# EAGLE design main (EAGLE 6.5.0)
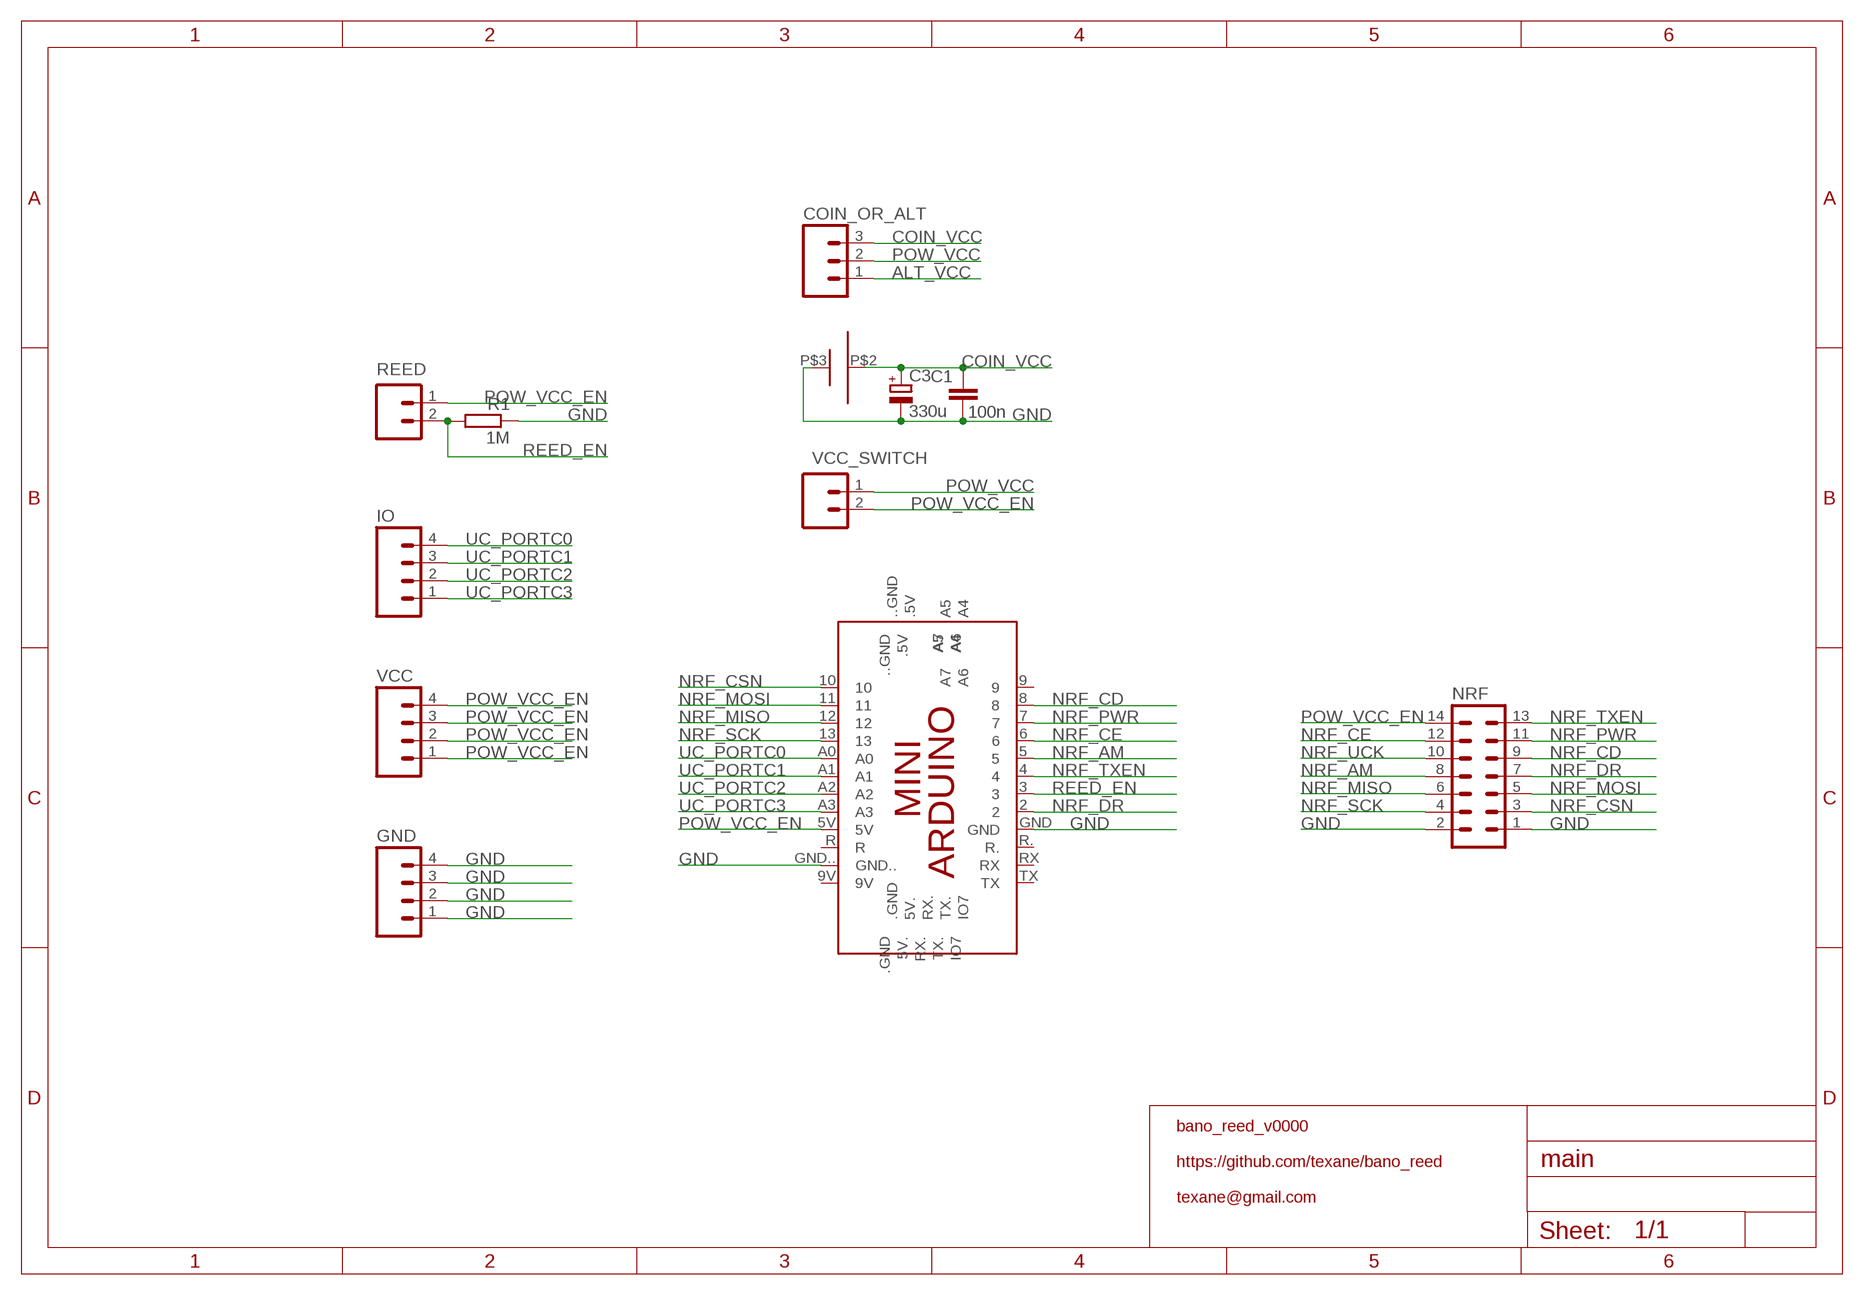
[diagram p0: schematic, sheet 1]

## Parts
C1  100n  C-EUC1206K  [C1206K]
C3  330u  CPOL-EUF  [PANASONIC_F]
COIN_OR_ALT  M03PTH  [1X03]
GND  M04PTH  [1X04]
IO  M04PTH  [1X04]
NRF  MA07-2  [MA07-2]
PCB1  ARDUINO_MINI  [ARDUINO_MINI]
R1  1M  R-EU_R1206  [R1206]
REED  M02PTH  [1X02]
U$1  KEYSTONE_1025_7  [KEYSTONE_1025_7]
VCC  M04PTH  [1X04]
VCC_SWITCH  M02PTH  [1X02]

## Nets
ALT_VCC: COIN_OR_ALT.1
COIN_VCC: C1.1 C3.+ COIN_OR_ALT.3 U$1.P$2(COIN_PLUS)
GND: C1.2 C3.- GND.1 GND.2 GND.3 GND.4 NRF.1 NRF.2 PCB1.GND PCB1.GND.. R1.1 U$1.P$3(COIN_MINUS)
NRF_AM: NRF.8 PCB1.5
NRF_CD: NRF.9 PCB1.8
NRF_CE: NRF.12 PCB1.6
NRF_CSN: NRF.3 PCB1.10
NRF_DR: NRF.7 PCB1.2
NRF_MISO: NRF.6 PCB1.12
NRF_MOSI: NRF.5 PCB1.11
NRF_PWR: NRF.11 PCB1.7
NRF_SCK: NRF.4 PCB1.13
NRF_TXEN: NRF.13 PCB1.4
NRF_UCK: NRF.10
POW_VCC: COIN_OR_ALT.2 VCC_SWITCH.1
POW_VCC_EN: NRF.14 PCB1.5V REED.1 VCC.1 VCC.2 VCC.3 VCC.4 VCC_SWITCH.2
REED_EN: PCB1.3 R1.2 REED.2
UC_PORTC0: IO.4 PCB1.A0
UC_PORTC1: IO.3 PCB1.A1
UC_PORTC2: IO.2 PCB1.A2
UC_PORTC3: IO.1 PCB1.A3
Unconnected: PCB1.5V. PCB1.9 PCB1.9V PCB1..5V PCB1...GND PCB1..GND PCB1.A4 PCB1.A5 PCB1.A6 PCB1.A7 PCB1.IO7 PCB1.R PCB1.R. PCB1.RX PCB1.RX. PCB1.TX PCB1.TX.

## Notes on the sheet
- bano_reed_v0000
- https://github.com/texane/bano_reed
- texane@gmail.com

## Library data of the parts
C1 = rcl:C-EU: CAPACITOR, European symbol
C3 = rcl:CPOL-EU: POLARIZED CAPACITOR, European symbol
COIN_OR_ALT = SparkFun:M03: Header 3 Standard 3-pin 0.1" header. Use with straight break away headers (SKU : PRT-00116), right angle break away headers (PRT-00553), swiss pins (PRT-00743), machine pins (PRT-00117), and female headers (PRT-00115). Molex polarized connector foot print use with SKU : PRT-08232 with associated crimp pins and housings.
GND IO VCC = SparkFun:M04: Header 4 Standard 4-pin 0.1" header. Use with straight break away headers (SKU : PRT-00116), right angle break away headers (PRT-00553), swiss pins (PRT-00743), machine pins (PRT-00117), and female headers (PRT-00115). Molex polarized connector foot print use with SKU : PRT-08231 with associated crimp pins and housings. 1MM SMD Version SKU: PRT-10208
NRF = con-lstb:MA07-2: PIN HEADER; OC_FARNELL: unknown; OC_NEWARK: unknown
PCB1 = E14_Arduino:ARDUINO_MINI: Device for representing an Arduino Mini board with a footprint in an EAGLE design. Created by Dave Young for Element14. More EAGLE documentation at: http://www.element14.com/community/community/knode/cadsoft_eagle
R1 = resistor:R-EU_: RESISTOR, European symbol
REED VCC_SWITCH = SparkFun:M02: Header 2 Standard 2-pin 0.1" header. Use with straight break away headers (SKU : PRT-00116), right angle break away headers (PRT-00553), swiss pins (PRT-00743), machine pins (PRT-00117), and female headers (PRT-00115). Molex polarized connector foot print use with SKU : PRT-08233 with associated crimp pins and housings.
U$1 = keystone_1025_7:KEYSTONE_1025_7

## Board
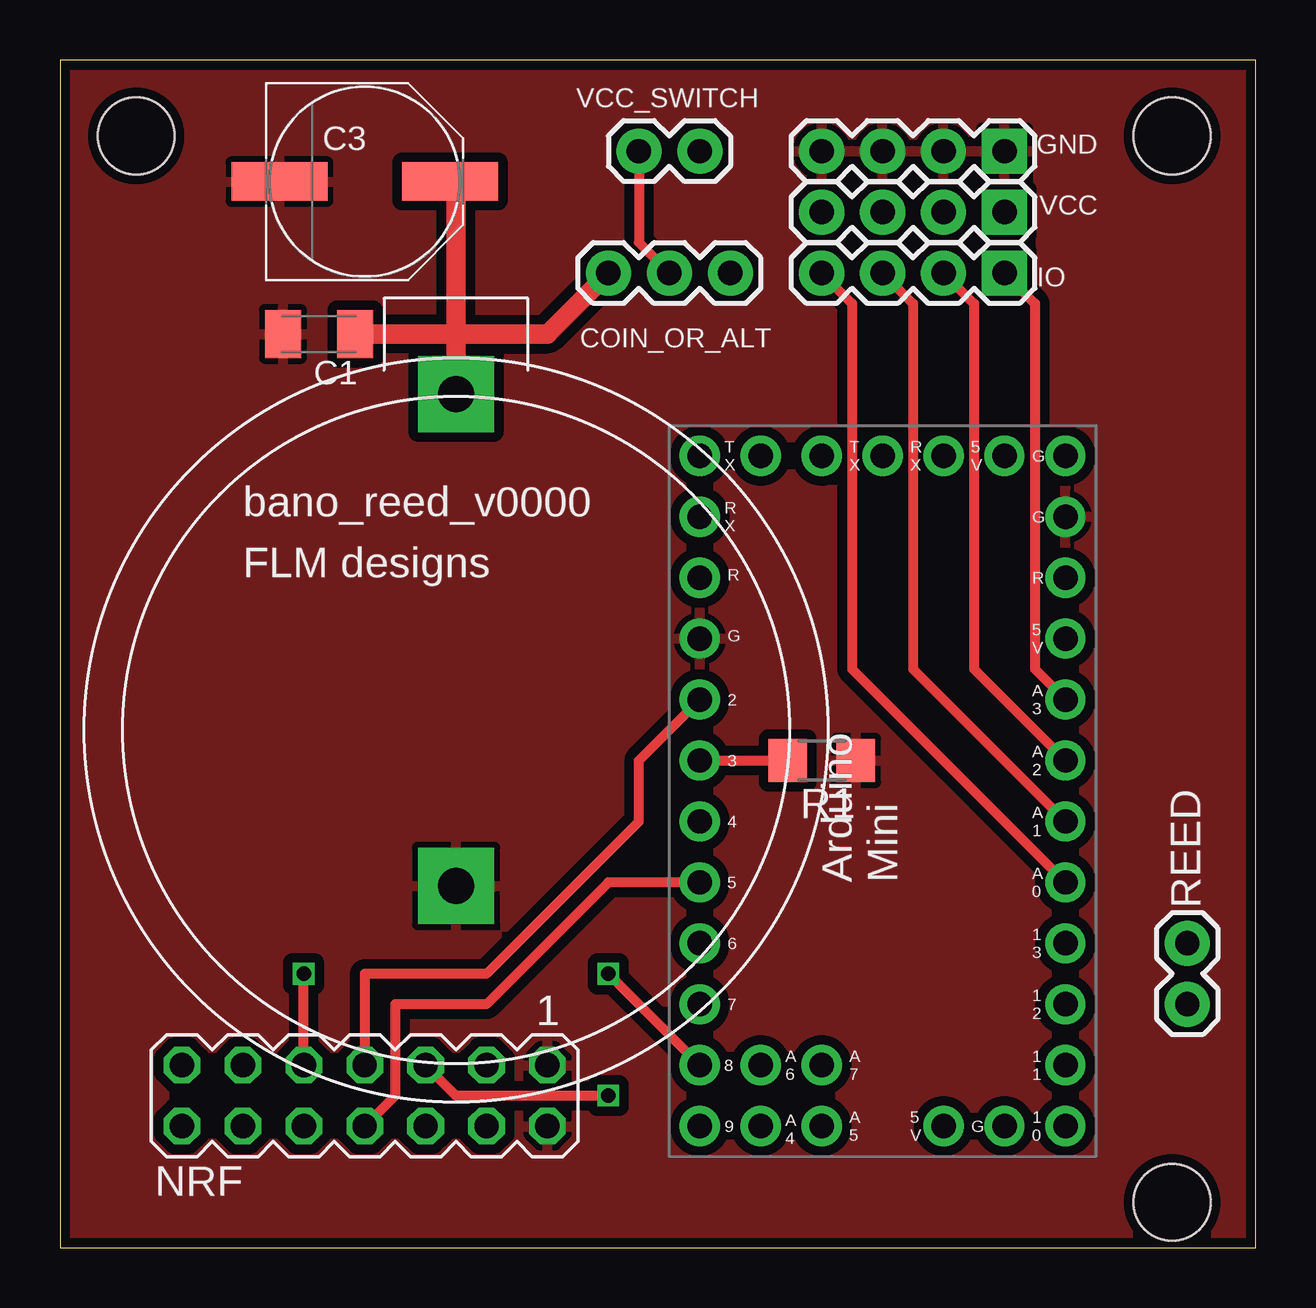
[diagram p1: board, top side]
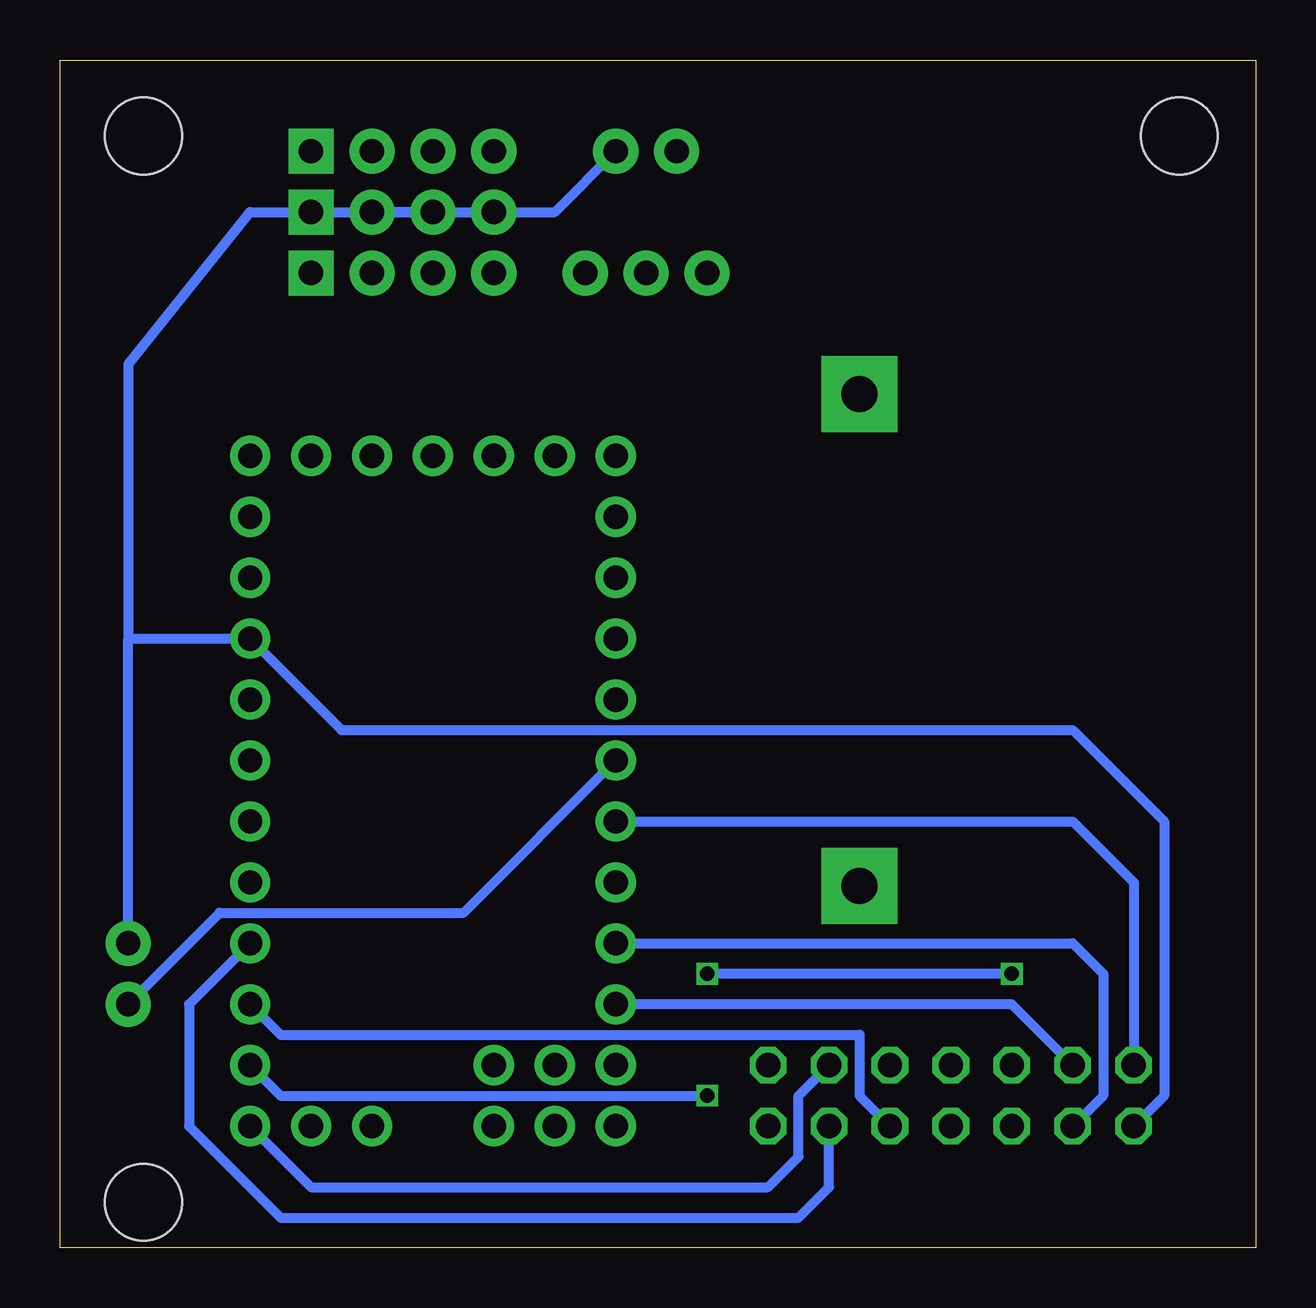
[diagram p2: board, bottom side, seen from below]

Size 49.84 x 49.52 mm. Coordinates in mm from the lower left corner, seen from the top.
Outline: 0,0 49.84,0 49.84,49.52 0,49.52 0,0
Copper layers (1*16): Top 0.035mm / dielectric 1.5mm / Bottom 0.035mm
Design rules "SeeedStudio_DRU_no_angle_2layer": minimum track width 6mil, minimum drill 12mil, track to track 6mil, track to pad 6mil, pad to pad 6mil, via to via 6mil, smd to smd 0mil, copper to edge 10mil, drill to drill 10mil, minimum pad ring 10mil, minimum via ring 6mil, stop-mask expansion 2mil, vias tented up to drill 25mil, thermal gap 10mil
Holes 3.2 mm at 3.17,46.35 46.35,46.35 46.35,1.91

### Footprints (pad centres in the part's own frame; a part is rotated, then mirrored left to right if it is on the bottom)
C1206K = smd 1.5 x 2: 1 -1.5,0; 2 1.5,0
PANASONIC_F = smd 4 x 1.6: + 3.55,0; - -3.55,0
1X03 = drill 1.016 pad 1.88: 1 0,0; 2 2.54,0; 3 5.08,0
1X04 = drill 1.016 pad 1.88 square: 1 0,0 | drill 1.016 pad 1.88: 2 2.54,0; 3 5.08,0; 4 7.62,0
MA07-2 = drill 1.016 octagon: 1 -7.62,-1.27; 2 -7.62,1.27; 3 -5.08,-1.27; 4 -5.08,1.27; 5 -2.54,-1.27; 6 -2.54,1.27; 7 0,-1.27; 8 0,1.27; 9 2.54,-1.27; 10 2.54,1.27; 11 5.08,-1.27; 12 5.08,1.27; 13 7.62,-1.27; 14 7.62,1.27
ARDUINO_MINI = drill 1.016 pad 1.676: 2 19.05,16.51; 3 16.51,16.51; 4 13.97,16.51; 5 11.43,16.51; 5V 21.59,1.27; 5V. 29.21,6.35; 6 8.89,16.51; 7 6.35,16.51; 8 3.81,16.51; 9 1.27,16.51; 9V 29.21,1.27; 10 1.27,1.27; 11 3.81,1.27; 12 6.35,1.27; 13 8.89,1.27; .5V 1.27,6.35; ..GND 1.27,3.81; .GND 29.21,3.81; A0 11.43,1.27; A1 13.97,1.27; A2 16.51,1.27; A3 19.05,1.27; A4 1.27,13.97; A5 1.27,11.43; A6 3.81,13.97; A7 3.81,11.43; GND 21.59,16.51; GND.. 26.67,1.27; IO7 29.21,13.97; R 24.13,1.27; R. 24.13,16.51; RX 26.67,16.51; RX. 29.21,8.89; TX 29.21,16.51; TX. 29.21,11.43
R1206 = smd 1.6 x 1.803: 1 -1.422,0; 2 1.422,0
1X02 = drill 1.016 pad 1.88: 1 0,0; 2 2.54,0
KEYSTONE_1025_7 = drill 1.5 pad 3.175 square: P$2 0,-14; P$3 0,6.5

### Placement (x,y rotation side)
C1  10.79,38.1 180 top
C3  12.7,44.45 0 top
COIN_OR_ALT  27.94,40.64 180 top
GND  39.37,45.72 180 top
IO  39.37,40.64 180 top
NRF  12.7,6.35 180 top
PCB1  43.18,3.81 90 top
R1  31.75,20.32 180 top
REED  46.99,12.7 270 top
U$1  16.51,21.59 180 top
VCC  39.37,43.18 180 top
VCC_SWITCH  24.13,45.72 0 top

### Tracks (layer width: path | path; a pad name or v marks a point on that pad's centre or on a via)
COIN_VCC
  Top 0.406: 16.51,44.45 C3.+
  Top 0.813: 16.51,38.1 20.32,38.1 COIN_OR_ALT.3 | 16.51,38.1 C1.1 | U$1.P$2 16.51,38.1 | 16.51,38.1 16.51,44.45
GND
  pour Top (isolate 0.406): 0,49.53 50.16,49.53 50.16,0 0,0
NRF_AM
  Top 0.406: PCB1.5 22.86,15.24 17.78,10.16 13.97,10.16 13.97,6.35 NRF.8
NRF_CD  (via drill 0.6)
  Top 0.406: NRF.9 v10.16,11.43 | PCB1.8 v22.86,11.43
  Bottom 0.406: v10.16,11.43 v22.86,11.43
NRF_CE
  Bottom 0.406: PCB1.6 7.62,12.7 6.35,11.43 6.35,6.35 NRF.12
NRF_CSN
  Bottom 0.406: PCB1.10 39.37,2.54 20.32,2.54 19.05,3.81 19.05,6.35 NRF.3
NRF_DR
  Top 0.406: PCB1.2 24.13,20.32 24.13,17.78 17.78,11.43 12.7,11.43 NRF.7
NRF_MISO
  Bottom 0.406: PCB1.12 40.64,8.89 16.51,8.89 16.51,6.35 NRF.6
NRF_MOSI  (via drill 0.6)
  Top 0.406: v22.86,6.35 16.51,6.35 NRF.5
  Bottom 0.406: PCB1.11 40.64,6.35 v22.86,6.35
NRF_PWR
  Bottom 0.406: NRF.11 10.16,10.16 PCB1.7
NRF_SCK
  Bottom 0.406: NRF.4 17.78,2.54 19.05,1.27 40.64,1.27 44.45,5.08 44.45,10.16 PCB1.13
NRF_TXEN
  Bottom 0.406: PCB1.4 7.62,17.78 5.08,15.24 NRF.13
POW_VCC
  Top 0.406: VCC_SWITCH.1 24.13,41.91 COIN_OR_ALT.2
POW_VCC_EN
  Bottom 0.406: REED.1 46.99,25.4 | 46.99,25.4 PCB1.5V 38.1,21.59 7.62,21.59 3.81,17.78 3.81,6.35 NRF.14 | VCC.1 VCC.2 VCC.3 VCC.4 | 46.99,25.4 46.99,36.83 41.91,43.18 VCC.1 | VCC.1 VCC.4 | VCC.4 29.21,43.18 VCC_SWITCH.2
REED_EN
  Top 0.406: PCB1.3 R1.2
  Bottom 0.406: REED.2 43.18,13.97 33.02,13.97 PCB1.3
UC_PORTC0
  Top 0.406: IO.4 33.02,39.37 33.02,24.13 PCB1.A0
UC_PORTC1
  Top 0.406: IO.3 35.56,39.37 35.56,24.13 PCB1.A1
UC_PORTC2
  Top 0.406: IO.2 38.1,39.37 38.1,24.13 PCB1.A2
UC_PORTC3
  Top 0.406: IO.1 40.64,39.37 40.64,24.13 PCB1.A3

### Text on the board
tNames: bano_reed_v0000 | FLM designs